# Altium schematic sheet TP1_NodoWiFi_Pwr_Rev0.SchDoc: Tp1 NodoWifi Pwr Rev0
size A4; Author: Alejandro Darío Sobral; SheetNumber: 3; SheetTotal: 5
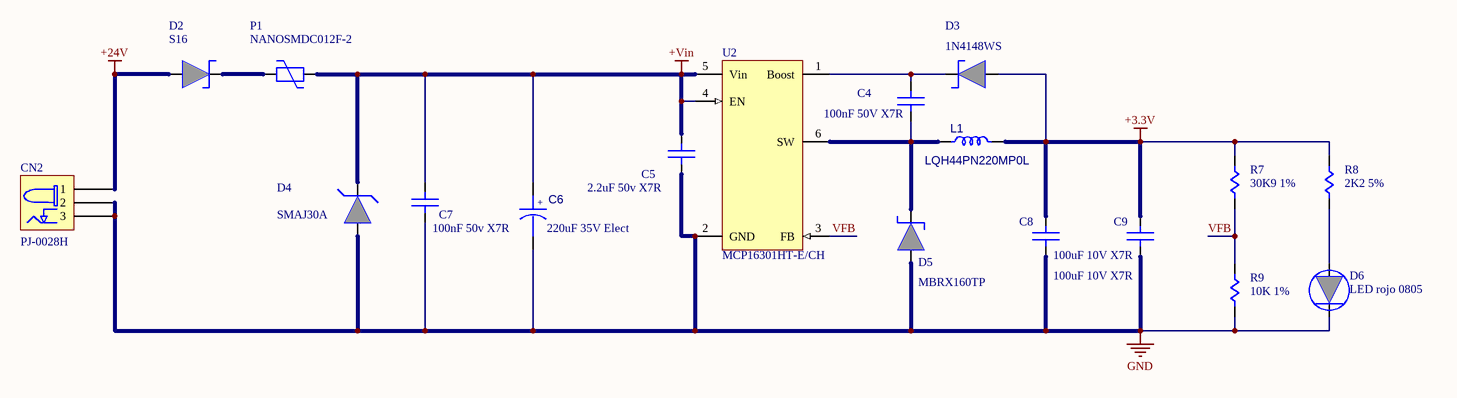
[diagram p0: TP1_NodoWiFi_Pwr_Rev0.SchDoc]

## Parts
C4  100nF 50V X7R  [C_0805]
C5  2.2uF 50v X7R  [C_0805]
C6  220uF 35V Elect  [C_RAD_0.135_H_8X12_S]
C7  100nF 50v X7R  [C_0805]
C8  100uF 10V X7R  [C_0805]
C9  100uF 10V X7R  [C_0805]
CN2  PJ-0028H  [PJ002B]
D2  S16  [D_0805]
D3  1N4148WS  [D_0805]
D4  SMAJ30A  [D_SMA]
D5  MBRX160TP  [SOD_123]
D6  LED rojo 0805  [D_0805]
L1  LQH44PN220MP0L  [LQH44]
P1  NANOSMDC012F-2  [C_1206]
R7  30K9 1%  [R_0805]
R8  2K2 5%  [R_0805]
R9  10K 1%  [R_0805]
U2  MCP16301HT-E/CH  [SOT23-6]

## Nets
+3.3V: C8.2(Cap) C9.2(Cap) D3.1(Cap) L1.2 R7.2(Cap) R8.2(Cap)
+24V: CN2.1 D2.1(Cap)
+Vin: C5.2(Cap) C6.1 C7.2(Cap) D4.2(Cap) P1.1(Cap) U2.4(EN) U2.5(Vin)
GND: C5.1(Cap) C6.2 C7.1(Cap) C8.1(Cap) C9.1(Cap) CN2.2 CN2.3 D4.1(Cap) D5.1(Cap) D6.2(Cap) R9.1(Cap) U2.2(GND)
VFB: R7.1(Cap) R9.2(Cap) U2.3(FB)
NetC4_1: C4.1(Cap) D5.2(Cap) L1.1 U2.6(SW)
NetC4_2: C4.2(Cap) D3.2(Cap) U2.1(Boost)
NetD2_2: D2.2(Cap) P1.2(Cap)
NetD6_1: D6.1(Cap) R8.1(Cap)

## Notes on the sheet
- Title:
- Size:
- Author:
- A4
- Sheet
- of
- Revision:
- File:
- Date:
- (in symbol CAP_P) +

## Library data of the parts
C4 C5 C7-C9 = Capacitor_NoP: capacitor no polarizado
C6 = CAP_P: Polarized Capacitor
CN2 = PJ-0028H: Conector PJ
D2 D3 D5 = Diodo Schottky: Schottky
D4 = Diodo Zener: Zener
D6 = Diodo LED: LED
L1 = IND: Inductor
P1 = Poly Switch
R7-R9 = Resistencia: Resistor
U2 = MCP16301: IC_DC/DC Buck controler